# EAGLE schematic eagle_Ultrasonic sensor arduino (EAGLE 9.5.1)
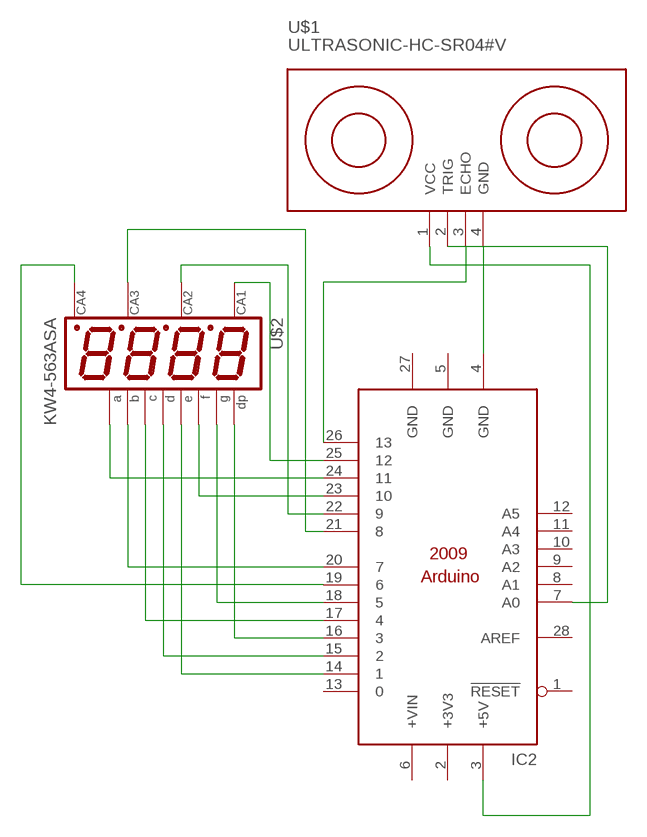
[diagram p0: schematic, sheet 1]

## Parts
IC2  ARDUINO2009_10  [ARDUINO2009]
U$1  ULTRASONIC-HC-SR04#V  [ULTRASONIC-HC-SR04#V]
U$2  KW4-563ASA  [NFD-5641]

## Nets
N$1: IC2.24 U$2.P$11
N$2: IC2.20 U$2.P$7
N$3: IC2.17 U$2.P$4
N$4: IC2.15 U$2.P$2
N$5: IC2.14 U$2.P$1
N$6: IC2.23 U$2.P$10
N$7: IC2.18 U$2.P$5
N$8: IC2.16 U$2.P$3
N$9: IC2.25 U$2.P$12
N$10: IC2.22 U$2.P$9
N$11: IC2.21 U$2.P$8
N$12: IC2.19 U$2.P$6
N$13: IC2.4(GND) U$1.4(GND)
N$14: IC2.3(+5V) U$1.1(VCC)
N$15: IC2.7(A0) U$1.2(TRIG)
N$16: IC2.26 U$1.3(ECHO)
Unconnected: IC2.1(!RESET) IC2.6(+VIN) IC2.8(A1) IC2.9(A2) IC2.10(A3) IC2.11(A4) IC2.12(A5) IC2.13 IC2.28(AREF)

## Power pins joined to a net without a drawn wire
+3V3: IC2.2(+3V3)
GND: IC2.5(GND) IC2.27(GND)

## Library data of the parts
IC2 = arduino:ARDUINO2009_1: The Arduino Duemilanove ("2009") is a microcontroller board based on the ATmega168 or ATmega328. - 14 digital input/output pins (of which 6 can be used as PWM outputs) - 6 analog inputs, a 16 MHz crystal oscillator - USB connection - power jack - ISP header - reset button It contains everything needed to support the microcontroller; simply connect it to a computer with a USB cable or power it with a AC-to-DC adapter or battery to get started http://arduino.cc/en/Main/ArduinoBoardDuemilanove
U$1 = diy-modules:ULTRASONIC-HC-SR04: Ultrasonic Ranging Module HC-SR04 More details available here: http://randomnerdtutorials.com/complete-guide-for-ultrasonic-sensor-hc-sr04/ Click here to find device on ebay.com <http://www.ebay.com/sch/hc+sr04+ultrasonic>
U$2 = KW4-563ASA:KW4-563ASA